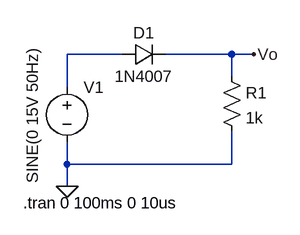
[diagram p0: schematic E3-rectificador-media-onda.asc]
E3-rectificador-media-onda.asc, the LTspice schematic file:
Version 4
SHEET 1 880 680
WIRE 48 80 -32 80
WIRE 208 80 112 80
WIRE 240 80 208 80
WIRE 208 112 208 80
WIRE -32 128 -32 80
WIRE -32 240 -32 208
WIRE 208 240 208 192
WIRE 208 240 -32 240
WIRE -32 272 -32 240
FLAG -32 272 0
FLAG 240 80 Vo
SYMBOL voltage -32 112 R0
WINDOW 3 -50 156 VLeft 2
WINDOW 123 0 0 Left 0
WINDOW 39 0 0 Left 0
SYMATTR InstName V1
SYMATTR Value SINE(0 15V 50Hz)
SYMBOL diode 48 64 M90
WINDOW 0 0 32 VBottom 2
WINDOW 3 32 32 VTop 2
SYMATTR InstName D1
SYMATTR Value 1N4007
SYMBOL res 192 96 R0
SYMATTR InstName R1
SYMATTR Value 1k
TEXT -96 296 Left 2 !.tran 0 100ms 0 10us

The netlist it stands for:
* E3-rectificador-media-onda.asc
V1 N001 0 SINE(0 15V 50Hz)
D1 N001 Vo 1N4007
R1 Vo 0 1k
.model D D
.lib standard.dio
.tran 0 100ms 0 10us
.backanno
.end